# EAGLE design 8x2AND_OR_1 (EAGLE 6.5.0)

## Sheet 1 of 6
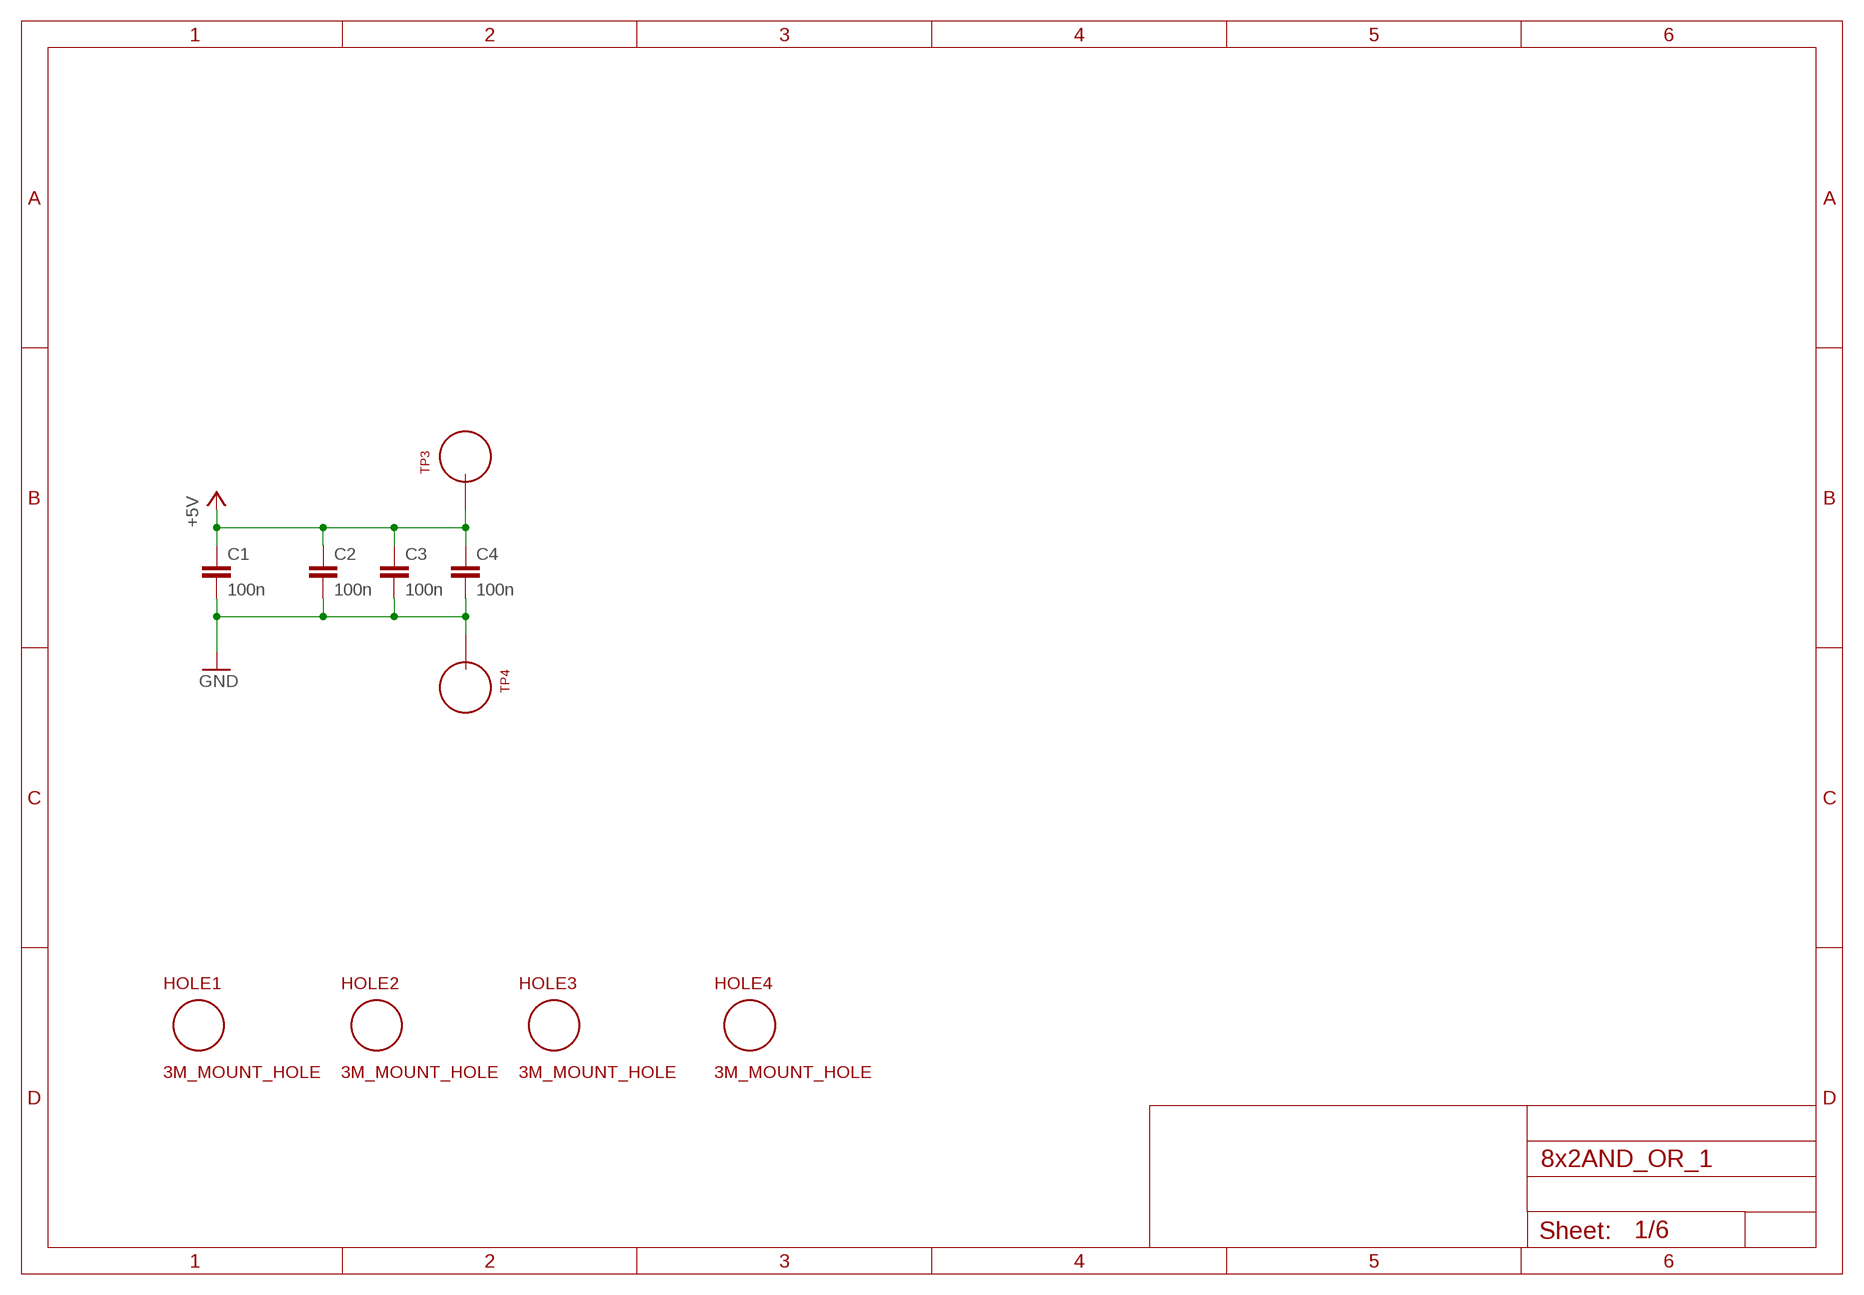
[diagram p0: schematic, sheet 1]

### Parts
C1  100n  C_P2INCH  [CAP_P2INCH]
C2  100n  C_P2INCH  [CAP_P2INCH]
C3  100n  C_P2INCH  [CAP_P2INCH]
C4  100n  C_P2INCH  [CAP_P2INCH]
HOLE1  3M_MOUNT_HOLE  [3M_HOLE]
HOLE2  3M_MOUNT_HOLE  [3M_HOLE]
HOLE3  3M_MOUNT_HOLE  [3M_HOLE]
HOLE4  3M_MOUNT_HOLE  [3M_HOLE]
TP3  TEST_LOOP  [TEST_LOOP]
TP4  TEST_LOOP  [TEST_LOOP]

### Nets
+5V: C1.1 C2.1 C3.1 C4.1 TP3.P$1 ; also sheet 2,3,4,5,6
GND: C1.2 C2.2 C3.2 C4.2 TP4.P$1 ; also sheet 2,3,4,5,6

## Sheet 2 of 6
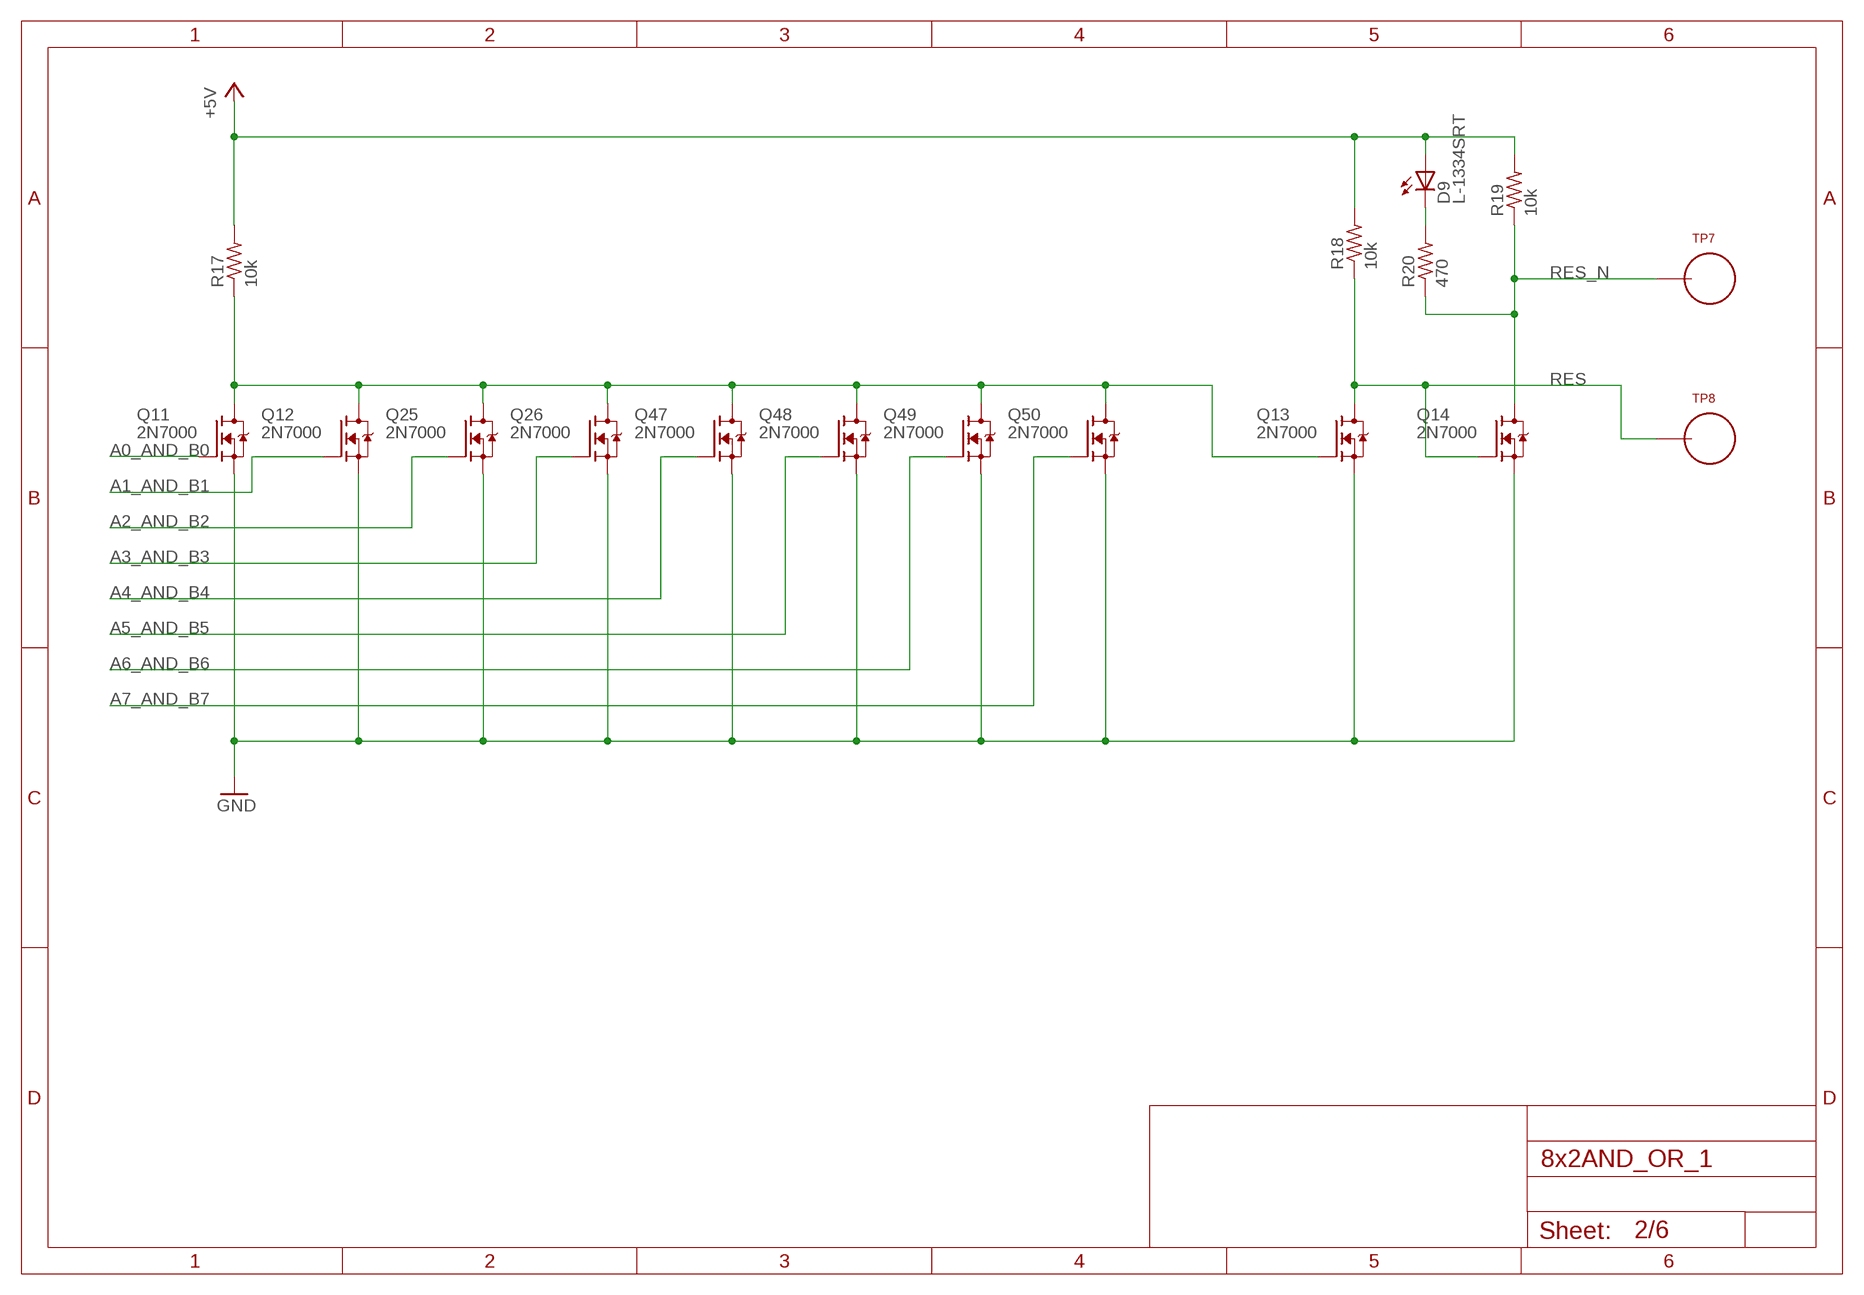
[diagram p1: schematic, sheet 2]

### Parts
D9  L-1334SRT  [LED3MM]
Q11  2N7000  [TO92-DGS]
Q12  2N7000  [TO92-DGS]
Q13  2N7000  [TO92-DGS]
Q14  2N7000  [TO92-DGS]
Q25  2N7000  [TO92-DGS]
Q26  2N7000  [TO92-DGS]
Q47  2N7000  [TO92-DGS]
Q48  2N7000  [TO92-DGS]
Q49  2N7000  [TO92-DGS]
Q50  2N7000  [TO92-DGS]
R17  10k  R_P2INCH  [R_P2INCH]
R18  10k  R_P2INCH  [R_P2INCH]
R19  10k  R_P2INCH  [R_P2INCH]
R20  470  R_P2INCH  [R_P2INCH]
TP7  TEST_LOOP  [TEST_LOOP]
TP8  TEST_LOOP  [TEST_LOOP]

### Nets
+5V: D9.A R17.2 R18.2 R19.2 ; also sheet 1,3,4,5,6
A0_AND_B0: Q11.G ; also sheet 3
A1_AND_B1: Q12.G ; also sheet 3
A2_AND_B2: Q25.G ; also sheet 4
A3_AND_B3: Q26.G ; also sheet 4
A4_AND_B4: Q47.G ; also sheet 5
A5_AND_B5: Q48.G ; also sheet 5
A6_AND_B6: Q49.G ; also sheet 6
A7_AND_B7: Q50.G ; also sheet 6
GND: Q11.S Q12.S Q13.S Q14.S Q25.S Q26.S Q47.S Q48.S Q49.S Q50.S ; also sheet 1,3,4,5,6
N$13: Q11.D Q12.D Q13.G Q25.D Q26.D Q47.D Q48.D Q49.D Q50.D R17.1
N$19: D9.K(C) R20.2
RES: Q13.D Q14.G R18.1 TP8.P$1
RES_N: Q14.D R19.1 R20.1 TP7.P$1

## Sheet 3 of 6
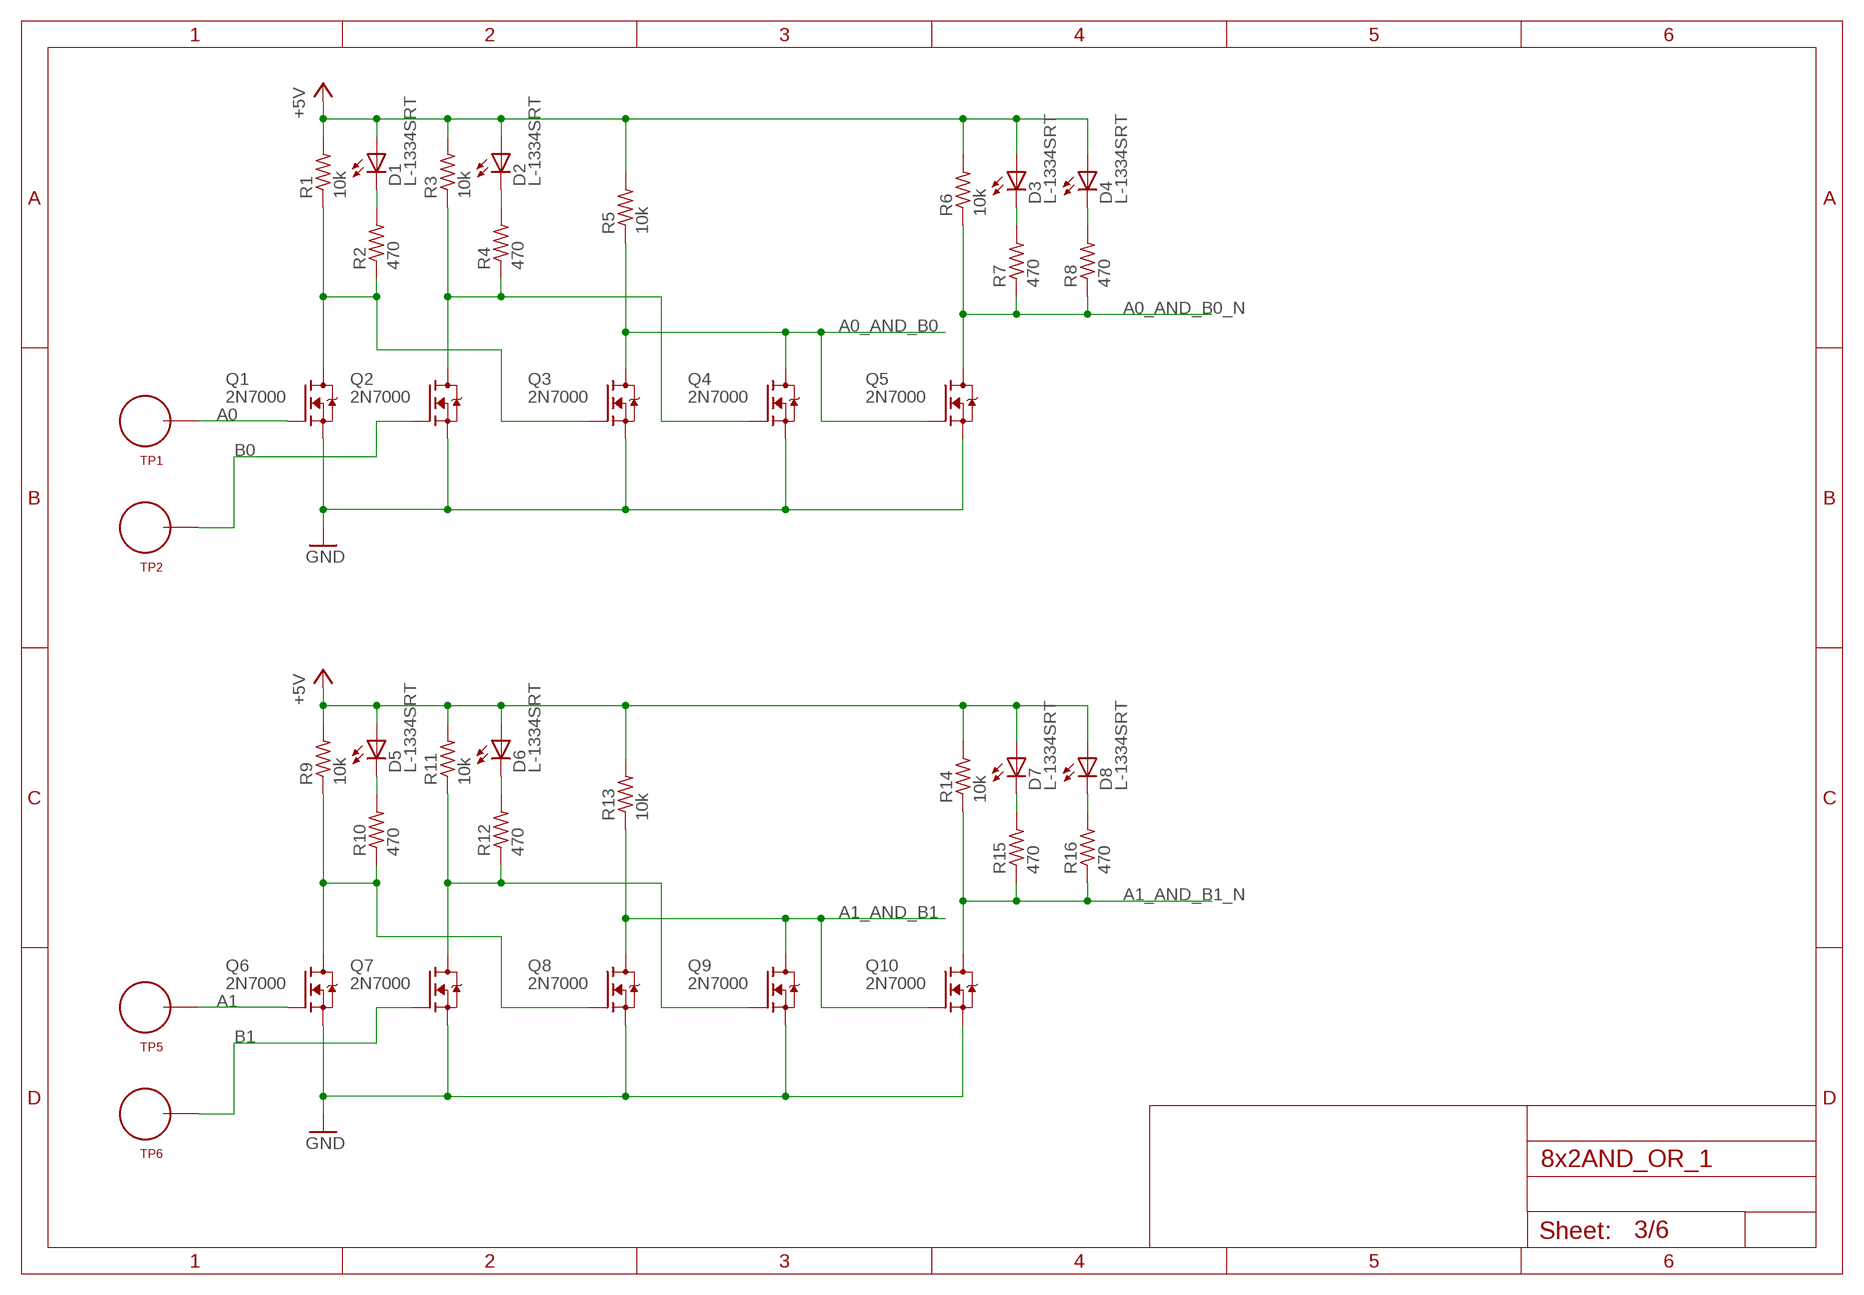
[diagram p2: schematic, sheet 3]

### Parts
D1  L-1334SRT  [LED3MM]
D2  L-1334SRT  [LED3MM]
D3  L-1334SRT  [LED3MM]
D4  L-1334SRT  [LED3MM]
D5  L-1334SRT  [LED3MM]
D6  L-1334SRT  [LED3MM]
D7  L-1334SRT  [LED3MM]
D8  L-1334SRT  [LED3MM]
Q1  2N7000  [TO92-DGS]
Q2  2N7000  [TO92-DGS]
Q3  2N7000  [TO92-DGS]
Q4  2N7000  [TO92-DGS]
Q5  2N7000  [TO92-DGS]
Q6  2N7000  [TO92-DGS]
Q7  2N7000  [TO92-DGS]
Q8  2N7000  [TO92-DGS]
Q9  2N7000  [TO92-DGS]
Q10  2N7000  [TO92-DGS]
R1  10k  R_P2INCH  [R_P2INCH]
R2  470  R_P2INCH  [R_P2INCH]
R3  10k  R_P2INCH  [R_P2INCH]
R4  470  R_P2INCH  [R_P2INCH]
R5  10k  R_P2INCH  [R_P2INCH]
R6  10k  R_P2INCH  [R_P2INCH]
R7  470  R_P2INCH  [R_P2INCH]
R8  470  R_P2INCH  [R_P2INCH]
R9  10k  R_P2INCH  [R_P2INCH]
R10  470  R_P2INCH  [R_P2INCH]
R11  10k  R_P2INCH  [R_P2INCH]
R12  470  R_P2INCH  [R_P2INCH]
R13  10k  R_P2INCH  [R_P2INCH]
R14  10k  R_P2INCH  [R_P2INCH]
R15  470  R_P2INCH  [R_P2INCH]
R16  470  R_P2INCH  [R_P2INCH]
TP1  TEST_LOOP  [TEST_LOOP]
TP2  TEST_LOOP  [TEST_LOOP]
TP5  TEST_LOOP  [TEST_LOOP]
TP6  TEST_LOOP  [TEST_LOOP]

### Nets
+5V: D1.A D2.A D3.A D4.A D5.A D6.A D7.A D8.A R1.2 R3.2 R5.2 R6.2 R9.2 R11.2 R13.2 R14.2 ; also sheet 1,2,4,5,6
A0: Q1.G TP1.P$1
A0_AND_B0: Q3.D Q4.D Q5.G R5.1 ; also sheet 2
A0_AND_B0_N: Q5.D R6.1 R7.1 R8.1
A1: Q6.G TP5.P$1
A1_AND_B1: Q8.D Q9.D Q10.G R13.1 ; also sheet 2
A1_AND_B1_N: Q10.D R14.1 R15.1 R16.1
B0: Q2.G TP2.P$1
B1: Q7.G TP6.P$1
GND: Q1.S Q2.S Q3.S Q4.S Q5.S Q6.S Q7.S Q8.S Q9.S Q10.S ; also sheet 1,2,4,5,6
N$1: D1.K(C) R2.2
N$2: Q1.D Q3.G R1.1 R2.1
N$3: D4.K(C) R8.2
N$4: D2.K(C) R4.2
N$5: Q2.D Q4.G R3.1 R4.1
N$6: D5.K(C) R10.2
N$7: Q6.D Q8.G R9.1 R10.1
N$8: D6.K(C) R12.2
N$9: D3.K(C) R7.2
N$10: Q7.D Q9.G R11.1 R12.1
N$11: D7.K(C) R15.2
N$12: D8.K(C) R16.2

## Sheet 4 of 6
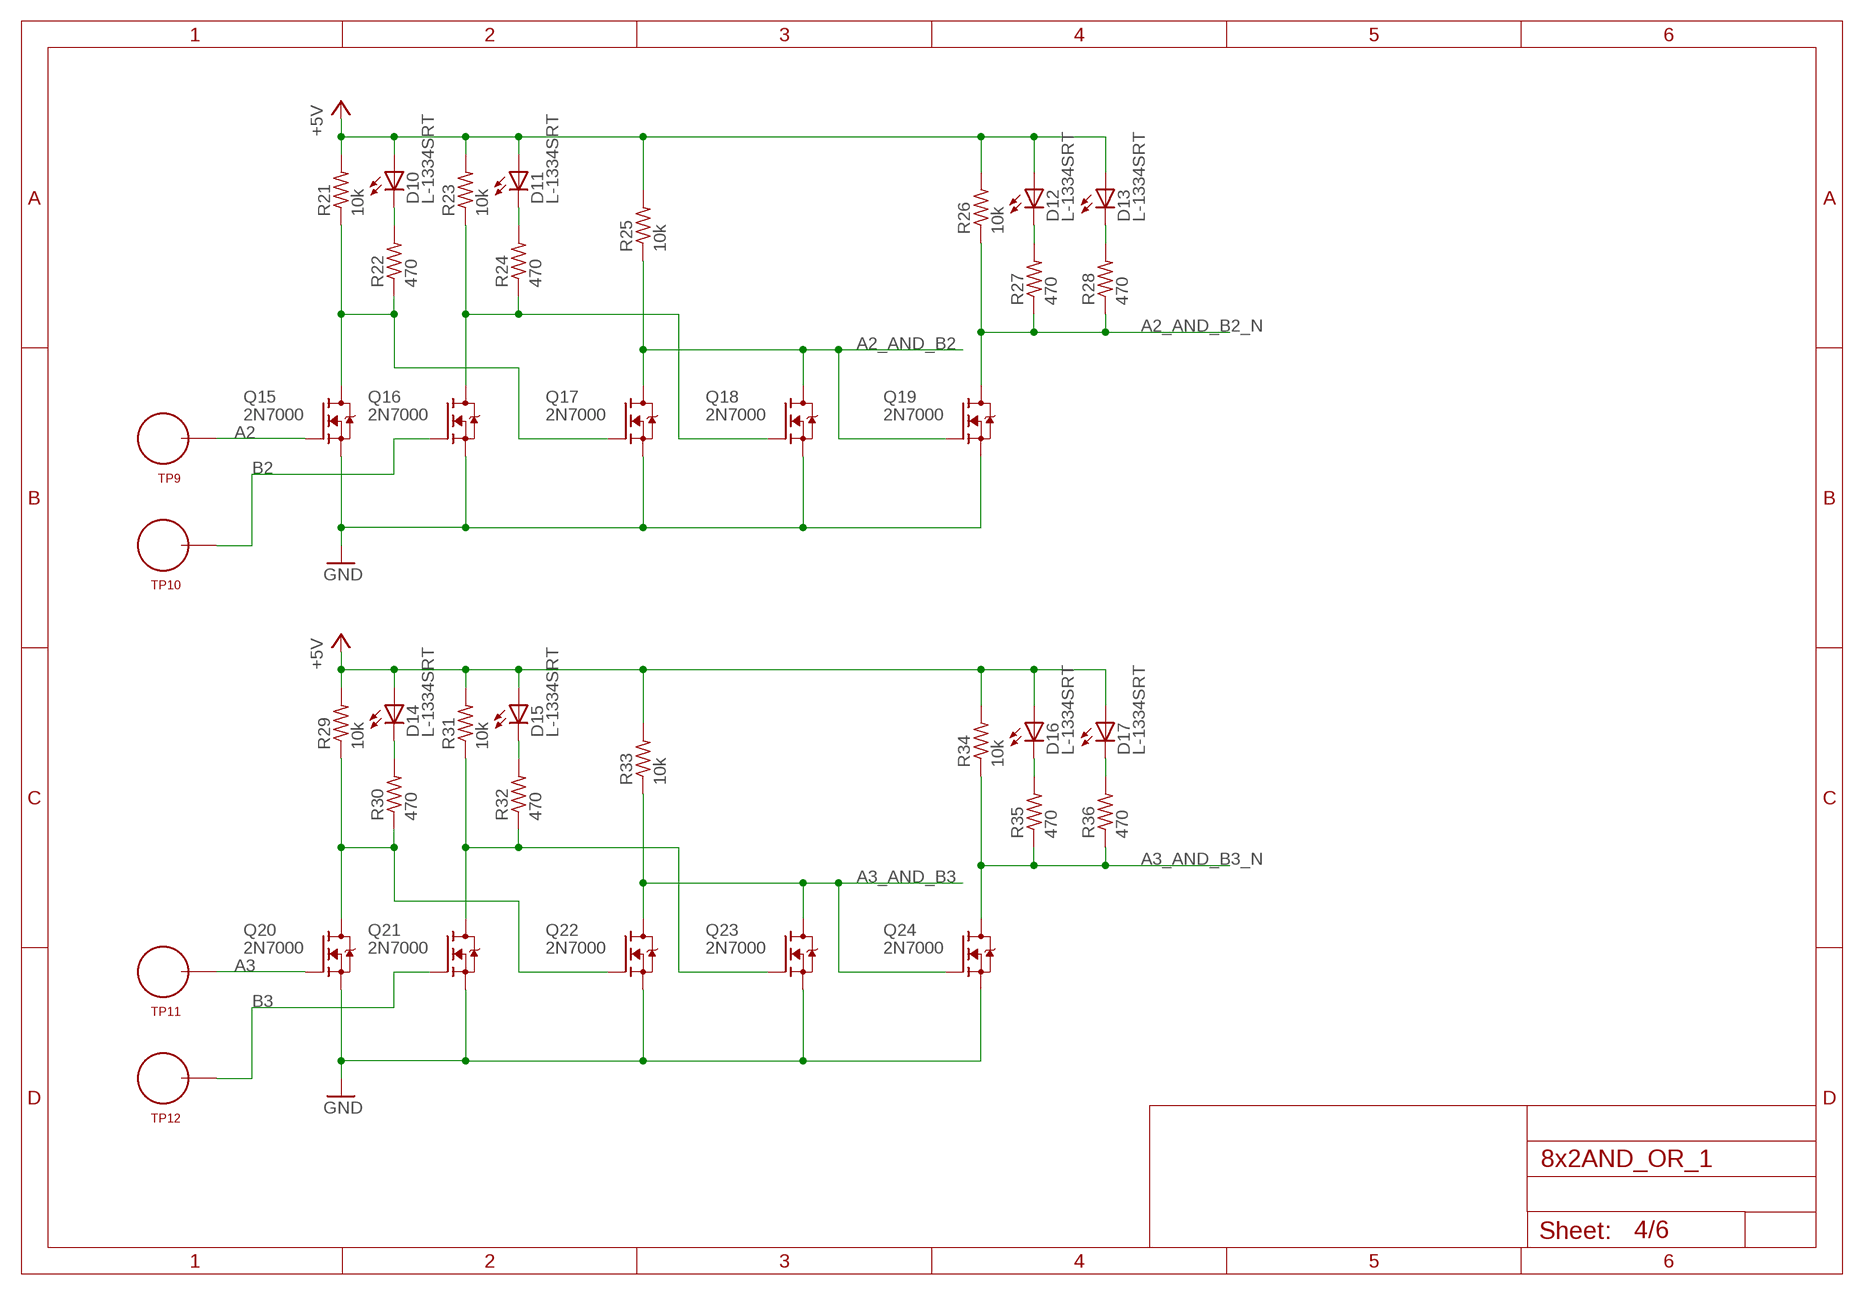
[diagram p3: schematic, sheet 4]

### Parts
D10  L-1334SRT  [LED3MM]
D11  L-1334SRT  [LED3MM]
D12  L-1334SRT  [LED3MM]
D13  L-1334SRT  [LED3MM]
D14  L-1334SRT  [LED3MM]
D15  L-1334SRT  [LED3MM]
D16  L-1334SRT  [LED3MM]
D17  L-1334SRT  [LED3MM]
Q15  2N7000  [TO92-DGS]
Q16  2N7000  [TO92-DGS]
Q17  2N7000  [TO92-DGS]
Q18  2N7000  [TO92-DGS]
Q19  2N7000  [TO92-DGS]
Q20  2N7000  [TO92-DGS]
Q21  2N7000  [TO92-DGS]
Q22  2N7000  [TO92-DGS]
Q23  2N7000  [TO92-DGS]
Q24  2N7000  [TO92-DGS]
R21  10k  R_P2INCH  [R_P2INCH]
R22  470  R_P2INCH  [R_P2INCH]
R23  10k  R_P2INCH  [R_P2INCH]
R24  470  R_P2INCH  [R_P2INCH]
R25  10k  R_P2INCH  [R_P2INCH]
R26  10k  R_P2INCH  [R_P2INCH]
R27  470  R_P2INCH  [R_P2INCH]
R28  470  R_P2INCH  [R_P2INCH]
R29  10k  R_P2INCH  [R_P2INCH]
R30  470  R_P2INCH  [R_P2INCH]
R31  10k  R_P2INCH  [R_P2INCH]
R32  470  R_P2INCH  [R_P2INCH]
R33  10k  R_P2INCH  [R_P2INCH]
R34  10k  R_P2INCH  [R_P2INCH]
R35  470  R_P2INCH  [R_P2INCH]
R36  470  R_P2INCH  [R_P2INCH]
TP9  TEST_LOOP  [TEST_LOOP]
TP10  TEST_LOOP  [TEST_LOOP]
TP11  TEST_LOOP  [TEST_LOOP]
TP12  TEST_LOOP  [TEST_LOOP]

### Nets
+5V: D10.A D11.A D12.A D13.A D14.A D15.A D16.A D17.A R21.2 R23.2 R25.2 R26.2 R29.2 R31.2 R33.2 R34.2 ; also sheet 1,2,3,5,6
A2: Q15.G TP9.P$1
A2_AND_B2: Q17.D Q18.D Q19.G R25.1 ; also sheet 2
A2_AND_B2_N: Q19.D R26.1 R27.1 R28.1
A3: Q20.G TP11.P$1
A3_AND_B3: Q22.D Q23.D Q24.G R33.1 ; also sheet 2
A3_AND_B3_N: Q24.D R34.1 R35.1 R36.1
B2: Q16.G TP10.P$1
B3: Q21.G TP12.P$1
GND: Q15.S Q16.S Q17.S Q18.S Q19.S Q20.S Q21.S Q22.S Q23.S Q24.S ; also sheet 1,2,3,5,6
N$14: D10.K(C) R22.2
N$15: Q15.D Q17.G R21.1 R22.1
N$16: D11.K(C) R24.2
N$17: Q16.D Q18.G R23.1 R24.1
N$18: D12.K(C) R27.2
N$20: D13.K(C) R28.2
N$21: D14.K(C) R30.2
N$22: Q20.D Q22.G R29.1 R30.1
N$23: D15.K(C) R32.2
N$24: Q21.D Q23.G R31.1 R32.1
N$25: D16.K(C) R35.2
N$26: D17.K(C) R36.2

## Sheet 5 of 6
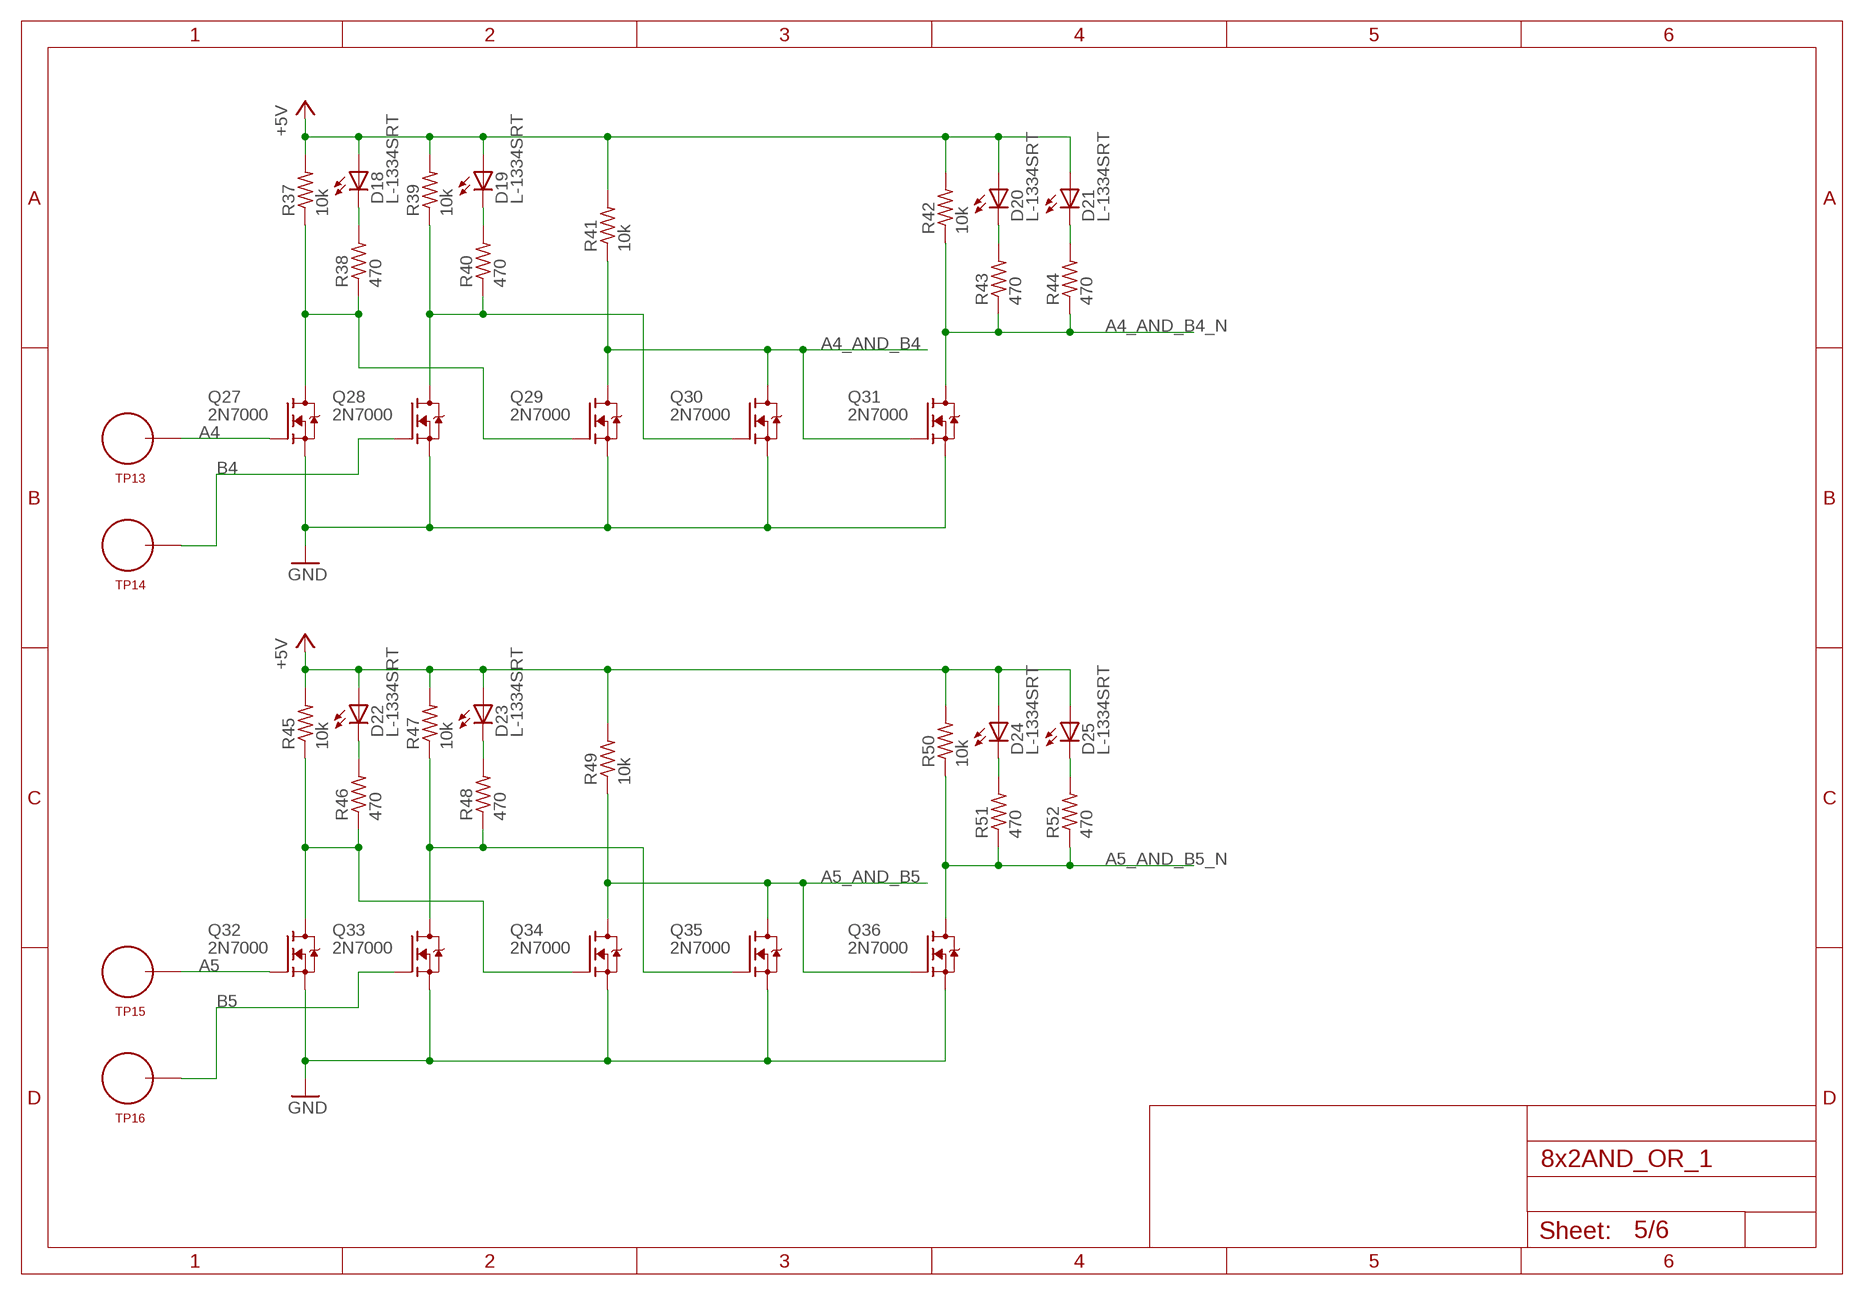
[diagram p4: schematic, sheet 5]

### Parts
D18  L-1334SRT  [LED3MM]
D19  L-1334SRT  [LED3MM]
D20  L-1334SRT  [LED3MM]
D21  L-1334SRT  [LED3MM]
D22  L-1334SRT  [LED3MM]
D23  L-1334SRT  [LED3MM]
D24  L-1334SRT  [LED3MM]
D25  L-1334SRT  [LED3MM]
Q27  2N7000  [TO92-DGS]
Q28  2N7000  [TO92-DGS]
Q29  2N7000  [TO92-DGS]
Q30  2N7000  [TO92-DGS]
Q31  2N7000  [TO92-DGS]
Q32  2N7000  [TO92-DGS]
Q33  2N7000  [TO92-DGS]
Q34  2N7000  [TO92-DGS]
Q35  2N7000  [TO92-DGS]
Q36  2N7000  [TO92-DGS]
R37  10k  R_P2INCH  [R_P2INCH]
R38  470  R_P2INCH  [R_P2INCH]
R39  10k  R_P2INCH  [R_P2INCH]
R40  470  R_P2INCH  [R_P2INCH]
R41  10k  R_P2INCH  [R_P2INCH]
R42  10k  R_P2INCH  [R_P2INCH]
R43  470  R_P2INCH  [R_P2INCH]
R44  470  R_P2INCH  [R_P2INCH]
R45  10k  R_P2INCH  [R_P2INCH]
R46  470  R_P2INCH  [R_P2INCH]
R47  10k  R_P2INCH  [R_P2INCH]
R48  470  R_P2INCH  [R_P2INCH]
R49  10k  R_P2INCH  [R_P2INCH]
R50  10k  R_P2INCH  [R_P2INCH]
R51  470  R_P2INCH  [R_P2INCH]
R52  470  R_P2INCH  [R_P2INCH]
TP13  TEST_LOOP  [TEST_LOOP]
TP14  TEST_LOOP  [TEST_LOOP]
TP15  TEST_LOOP  [TEST_LOOP]
TP16  TEST_LOOP  [TEST_LOOP]

### Nets
+5V: D18.A D19.A D20.A D21.A D22.A D23.A D24.A D25.A R37.2 R39.2 R41.2 R42.2 R45.2 R47.2 R49.2 R50.2 ; also sheet 1,2,3,4,6
A4: Q27.G TP13.P$1
A4_AND_B4: Q29.D Q30.D Q31.G R41.1 ; also sheet 2
A4_AND_B4_N: Q31.D R42.1 R43.1 R44.1
A5: Q32.G TP15.P$1
A5_AND_B5: Q34.D Q35.D Q36.G R49.1 ; also sheet 2
A5_AND_B5_N: Q36.D R50.1 R51.1 R52.1
B4: Q28.G TP14.P$1
B5: Q33.G TP16.P$1
GND: Q27.S Q28.S Q29.S Q30.S Q31.S Q32.S Q33.S Q34.S Q35.S Q36.S ; also sheet 1,2,3,4,6
N$27: D18.K(C) R38.2
N$28: Q27.D Q29.G R37.1 R38.1
N$29: D19.K(C) R40.2
N$30: Q28.D Q30.G R39.1 R40.1
N$31: D20.K(C) R43.2
N$32: D21.K(C) R44.2
N$33: D22.K(C) R46.2
N$34: Q32.D Q34.G R45.1 R46.1
N$35: D23.K(C) R48.2
N$36: Q33.D Q35.G R47.1 R48.1
N$37: D24.K(C) R51.2
N$38: D25.K(C) R52.2

## Sheet 6 of 6
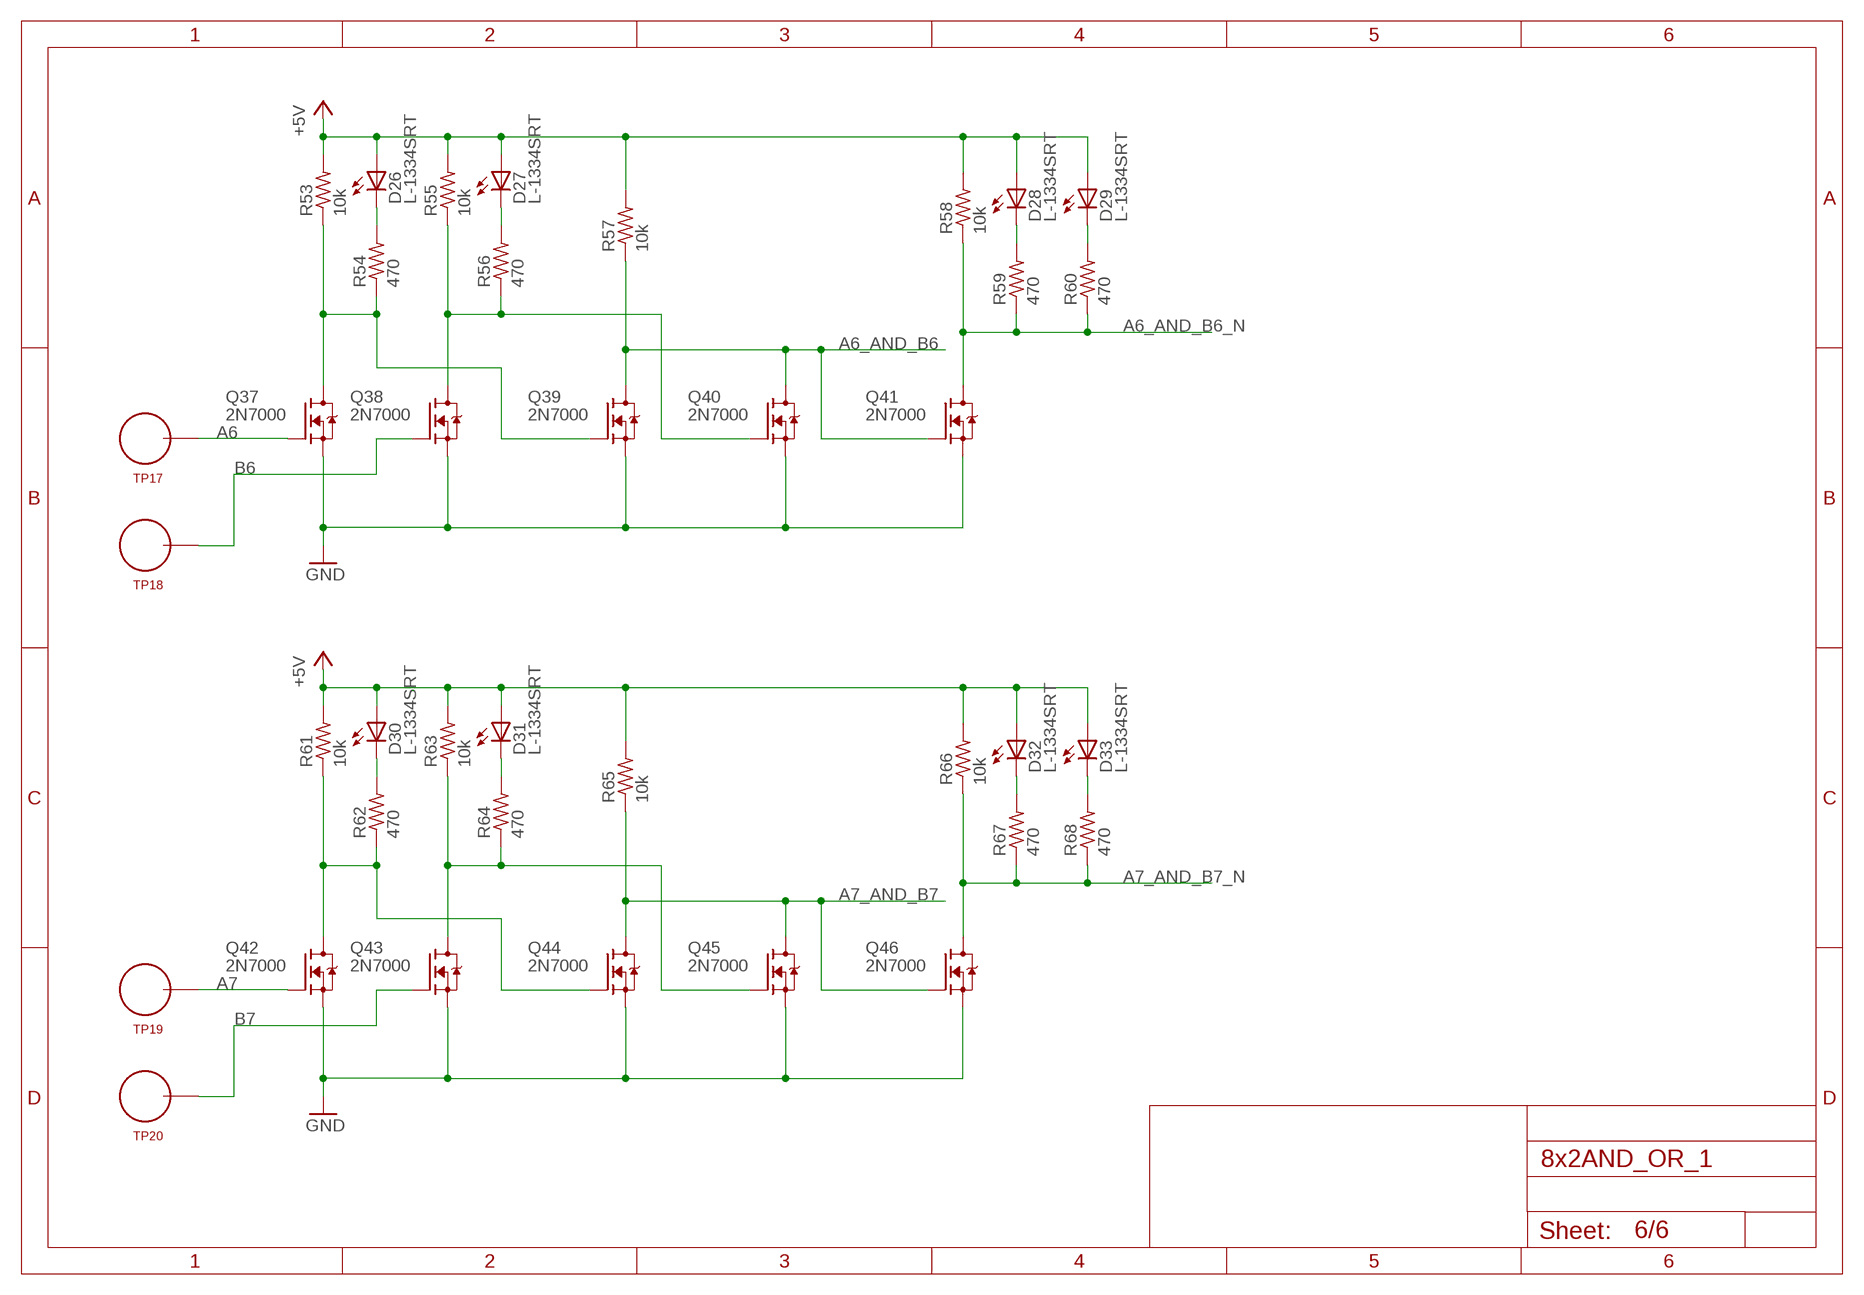
[diagram p5: schematic, sheet 6]

### Parts
D26  L-1334SRT  [LED3MM]
D27  L-1334SRT  [LED3MM]
D28  L-1334SRT  [LED3MM]
D29  L-1334SRT  [LED3MM]
D30  L-1334SRT  [LED3MM]
D31  L-1334SRT  [LED3MM]
D32  L-1334SRT  [LED3MM]
D33  L-1334SRT  [LED3MM]
Q37  2N7000  [TO92-DGS]
Q38  2N7000  [TO92-DGS]
Q39  2N7000  [TO92-DGS]
Q40  2N7000  [TO92-DGS]
Q41  2N7000  [TO92-DGS]
Q42  2N7000  [TO92-DGS]
Q43  2N7000  [TO92-DGS]
Q44  2N7000  [TO92-DGS]
Q45  2N7000  [TO92-DGS]
Q46  2N7000  [TO92-DGS]
R53  10k  R_P2INCH  [R_P2INCH]
R54  470  R_P2INCH  [R_P2INCH]
R55  10k  R_P2INCH  [R_P2INCH]
R56  470  R_P2INCH  [R_P2INCH]
R57  10k  R_P2INCH  [R_P2INCH]
R58  10k  R_P2INCH  [R_P2INCH]
R59  470  R_P2INCH  [R_P2INCH]
R60  470  R_P2INCH  [R_P2INCH]
R61  10k  R_P2INCH  [R_P2INCH]
R62  470  R_P2INCH  [R_P2INCH]
R63  10k  R_P2INCH  [R_P2INCH]
R64  470  R_P2INCH  [R_P2INCH]
R65  10k  R_P2INCH  [R_P2INCH]
R66  10k  R_P2INCH  [R_P2INCH]
R67  470  R_P2INCH  [R_P2INCH]
R68  470  R_P2INCH  [R_P2INCH]
TP17  TEST_LOOP  [TEST_LOOP]
TP18  TEST_LOOP  [TEST_LOOP]
TP19  TEST_LOOP  [TEST_LOOP]
TP20  TEST_LOOP  [TEST_LOOP]

### Nets
+5V: D26.A D27.A D28.A D29.A D30.A D31.A D32.A D33.A R53.2 R55.2 R57.2 R58.2 R61.2 R63.2 R65.2 R66.2 ; also sheet 1,2,3,4,5
A6: Q37.G TP17.P$1
A6_AND_B6: Q39.D Q40.D Q41.G R57.1 ; also sheet 2
A6_AND_B6_N: Q41.D R58.1 R59.1 R60.1
A7: Q42.G TP19.P$1
A7_AND_B7: Q44.D Q45.D Q46.G R65.1 ; also sheet 2
A7_AND_B7_N: Q46.D R66.1 R67.1 R68.1
B6: Q38.G TP18.P$1
B7: Q43.G TP20.P$1
GND: Q37.S Q38.S Q39.S Q40.S Q41.S Q42.S Q43.S Q44.S Q45.S Q46.S ; also sheet 1,2,3,4,5
N$39: D26.K(C) R54.2
N$40: Q37.D Q39.G R53.1 R54.1
N$41: D27.K(C) R56.2
N$42: Q38.D Q40.G R55.1 R56.1
N$43: D28.K(C) R59.2
N$44: D29.K(C) R60.2
N$45: D30.K(C) R62.2
N$46: Q42.D Q44.G R61.1 R62.1
N$47: D31.K(C) R64.2
N$48: Q43.D Q45.G R63.1 R64.1
N$49: D32.K(C) R67.2
N$50: D33.K(C) R68.2

## Library data of the parts
C1-C4 = MyLib:C_P2INCH
D1-D33 = MyLib:L-1334SRT
HOLE1-HOLE4 = MyLib:3M_MOUNT_HOLE
Q1-Q50 = MyLib:2N7000
R1-R68 = MyLib:R_P2INCH
TP1-TP20 = MyLib:TEST_LOOP

## Board
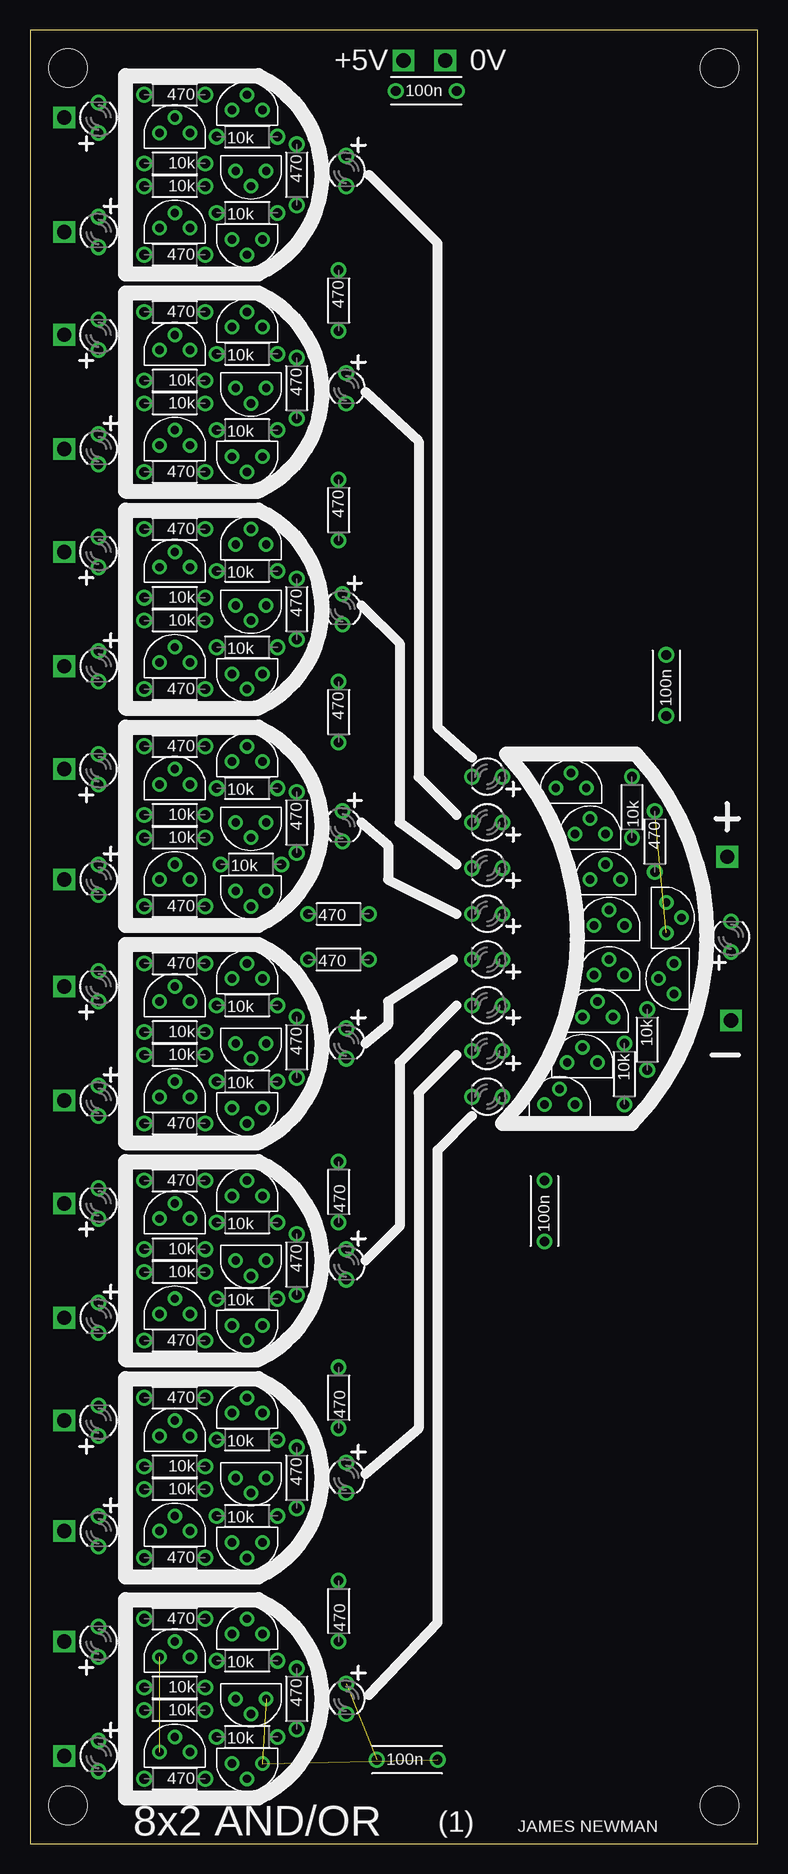
[diagram p6: board, top side]
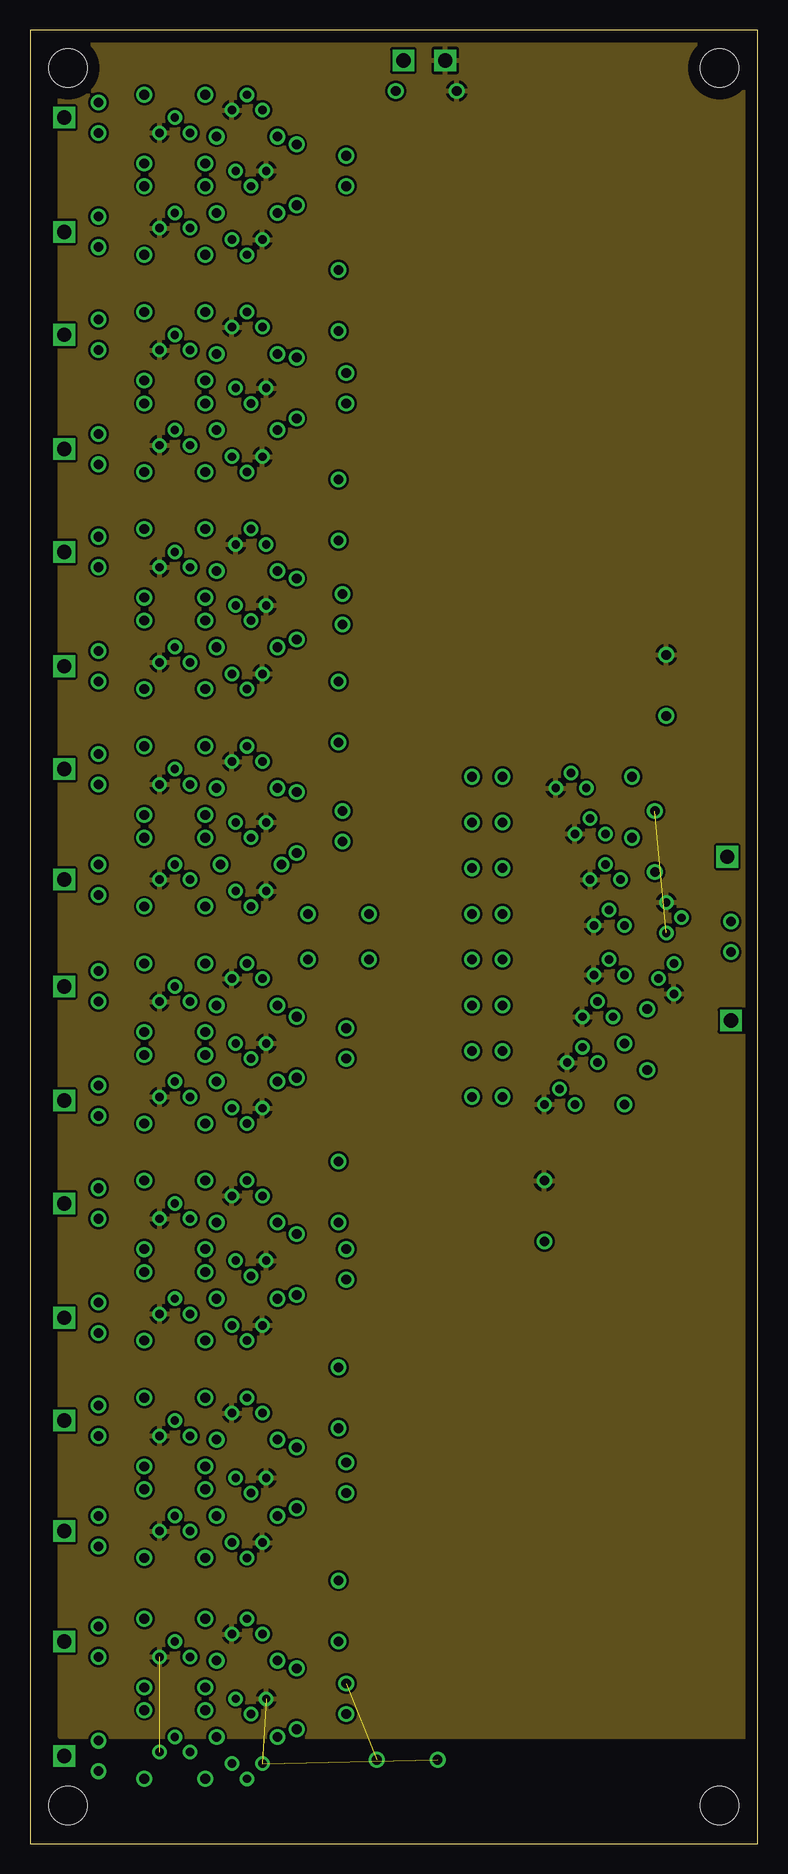
[diagram p7: board, inner layer Route2]
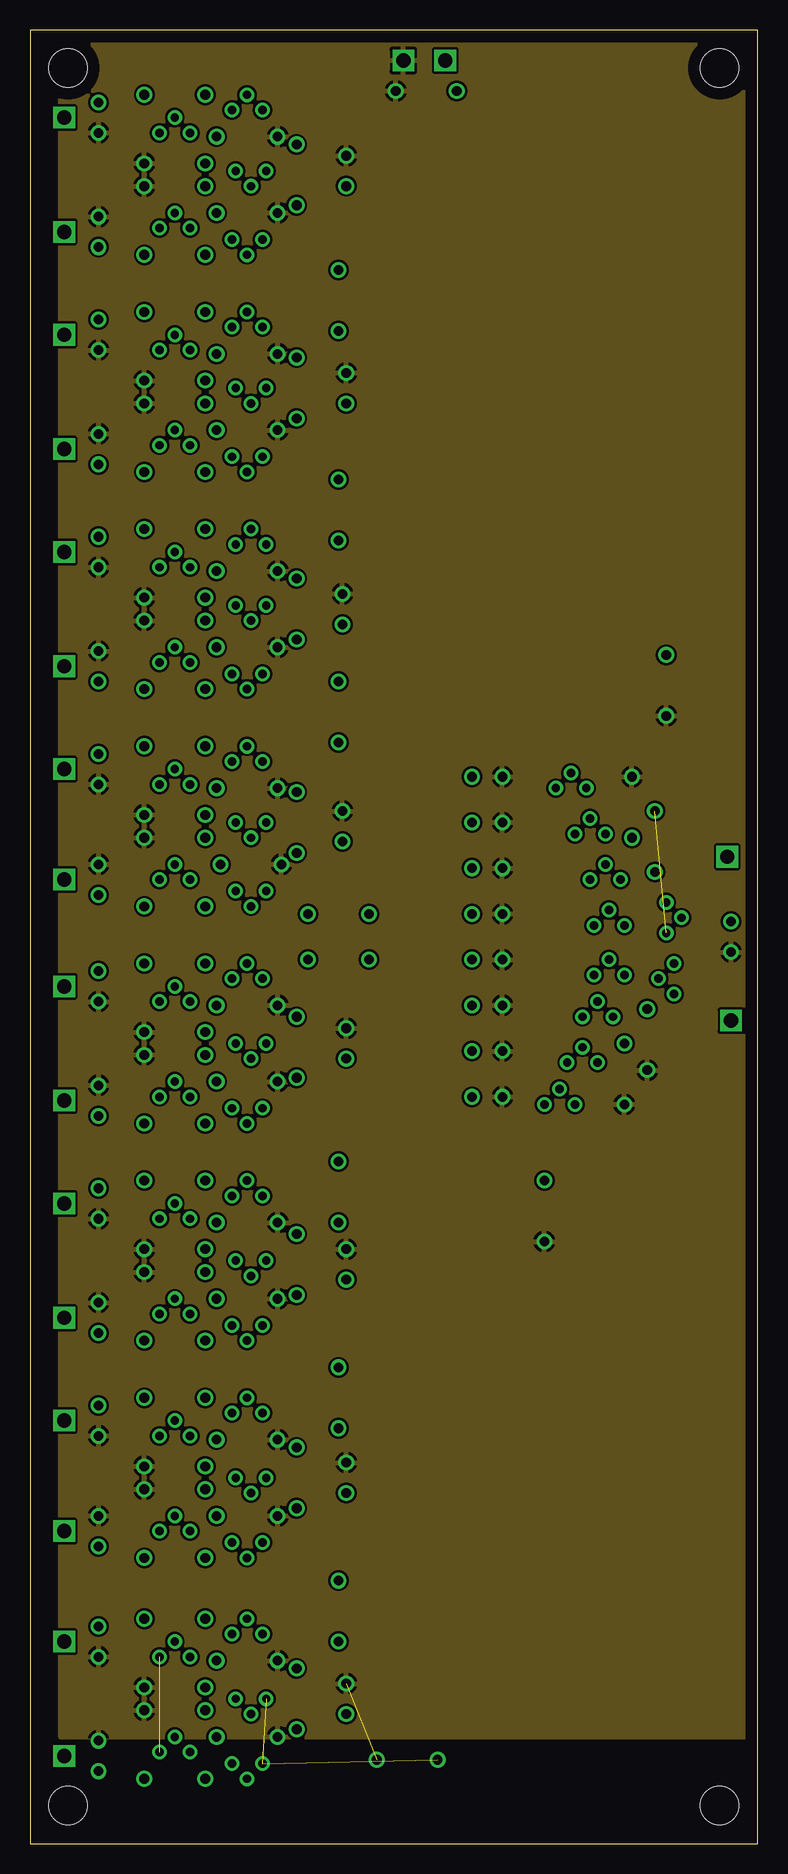
[diagram p8: board, inner layer Route3]
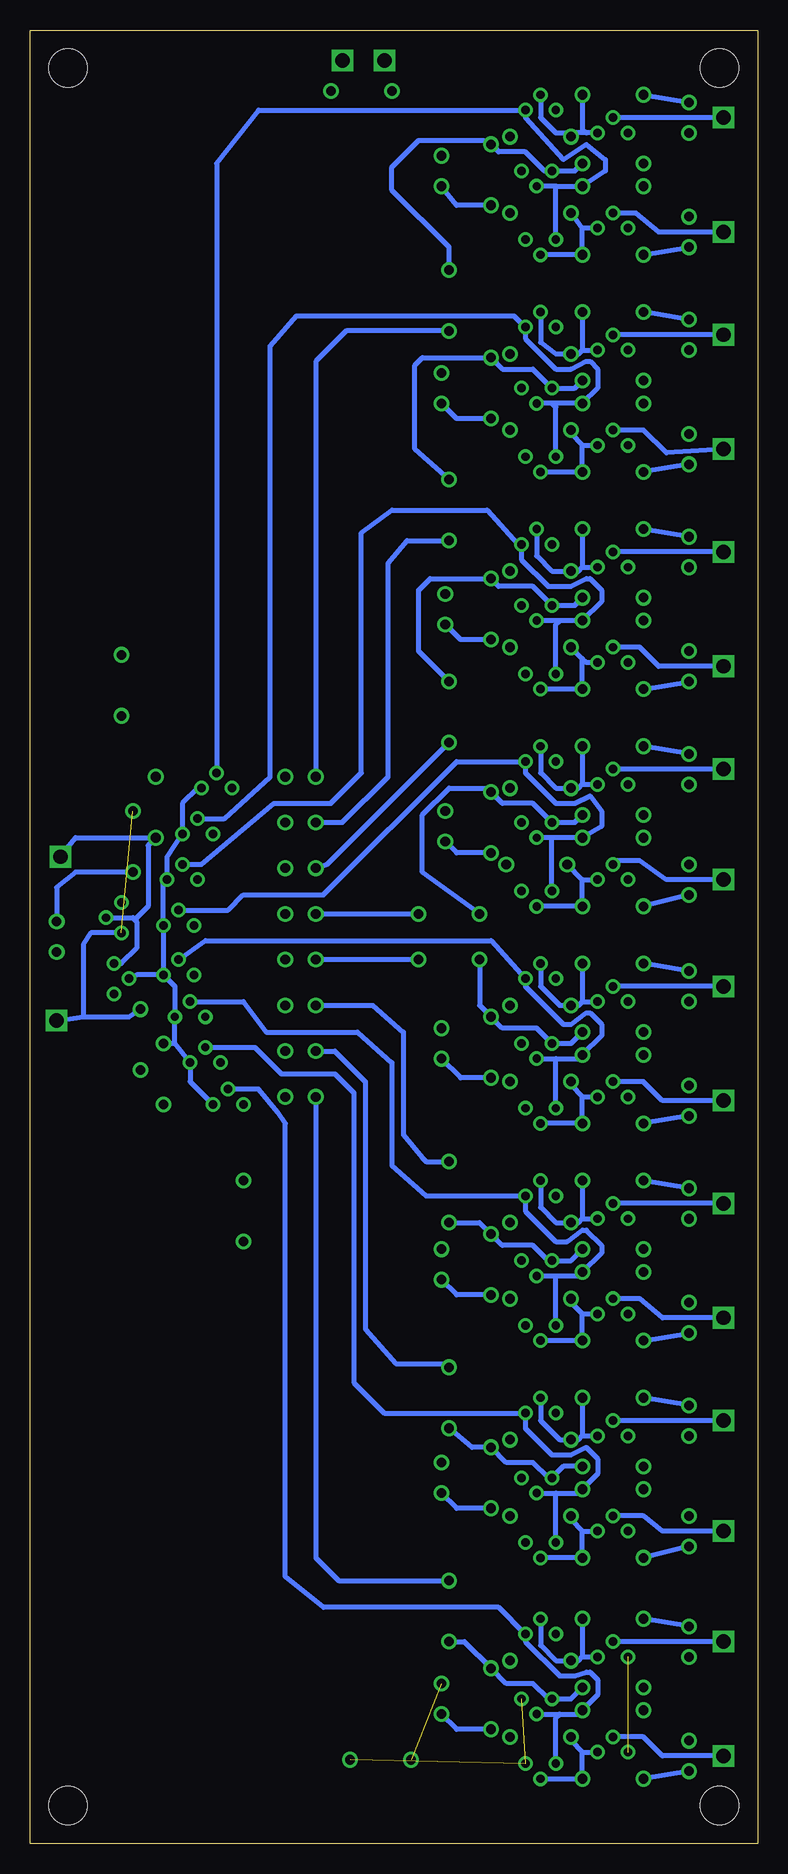
[diagram p9: board, bottom side, seen from below]

Size 60.64 x 151.13 mm. Coordinates in mm from the lower left corner, seen from the top.
Outline: 0,0 60.64,0 60.64,151.13 0,151.13 0,0
Copper layers (1*2+3*16): Top 0.035mm / dielectric 0.2mm / Route2 0.035mm / dielectric 1mm / Route3 0.035mm / dielectric 0.2mm / Bottom 0.035mm
Design rules "processor_rules_4layer": minimum track width 10mil, minimum drill 0.0236mm, track to track 8mil, track to pad 8mil, pad to pad 8mil, via to via 8mil, smd to smd 8mil, copper to edge 40mil, drill to drill 8mil, minimum pad ring 10mil, minimum via ring 8mil, stop-mask expansion 4mil, vias tented up to drill 0.7mm, thermal gap 10mil

### Footprints (pad centres in the part's own frame; a part is rotated, then mirrored left to right if it is on the bottom)
CAP_P2INCH = drill 0.8: 1 -2.54,0; 2 2.54,0
LED3MM = drill 0.8: A -1.27,0; K 1.27,0
3M_HOLE = hole 3.2: 0,0
TO92-DGS = drill 0.7: D 0,1.27; G -1.27,0; S 0,-1.27
R_P2INCH = drill 0.8: 1 -2.54,0; 2 2.54,0
TEST_LOOP = drill 1.2 square: P$1 0,0

### Placement (x,y rotation side)
C1  33.02,146.05 0 top
C2  42.86,52.7 90 top
C3  53.02,96.52 90 top
C4  31.43,6.99 0 top
D1  5.71,143.83 90 top
D2  5.71,134.3 270 top
D3  26.35,139.38 270 top
D4  38.1,88.9 180 top
D5  5.71,125.73 90 top
D6  5.71,116.2 270 top
D7  26.35,121.28 270 top
D8  38.1,85.09 180 top
D9  58.42,75.56 90 top
D10  5.71,107.63 90 top
D11  5.71,98.11 270 top
D12  26.04,102.87 270 top
D13  38.1,81.28 180 top
D14  5.71,89.53 90 top
D15  5.71,80.33 270 top
D16  26.04,84.77 270 top
D17  38.1,77.47 180 top
D18  5.71,71.44 90 top
D19  5.71,61.91 270 top
D20  26.35,66.67 270 top
D21  38.1,73.66 180 top
D22  5.71,53.34 90 top
D23  5.71,43.81 270 top
D24  26.35,48.26 270 top
D25  38.1,69.85 180 top
D26  5.71,35.24 90 top
D27  5.71,26.04 270 top
D28  26.35,30.48 270 top
D29  38.1,66.04 180 top
D30  5.71,16.83 90 top
D31  5.71,7.3 270 top
D32  26.35,12.06 270 top
D33  38.1,62.23 180 top
HOLE1  3.17,3.17 0 top
HOLE2  57.47,3.17 0 top
HOLE3  3.17,147.96 0 top
HOLE4  57.47,147.96 0 top
Q1  12.06,142.56 270 top
Q2  12.06,134.62 270 top
Q3  18.1,144.46 270 top
Q4  18.1,133.67 90 top
Q5  18.41,139.38 90 top
Q6  12.06,124.46 270 top
Q7  12.06,116.52 270 top
Q8  18.1,126.36 270 top
Q9  18.1,115.57 90 top
Q10  18.41,121.28 90 top
Q11  45.09,87.95 270 top
Q12  46.67,84.14 270 top
Q13  53.66,72.07 0 top
Q14  53.02,77.15 180 top
Q15  12.06,106.36 270 top
Q16  12.06,98.42 270 top
Q17  18.41,108.27 270 top
Q18  18.1,97.47 90 top
Q19  18.41,103.19 90 top
Q20  12.06,88.27 270 top
Q21  12.06,80.33 270 top
Q22  18.1,90.17 270 top
Q23  18.41,79.38 90 top
Q24  18.41,85.09 90 top
Q25  47.94,80.33 270 top
Q26  48.26,76.52 270 top
Q27  12.06,70.17 270 top
Q28  12.06,62.23 270 top
Q29  18.1,72.07 270 top
Q30  18.1,61.28 90 top
Q31  18.41,66.67 90 top
Q32  12.06,52.07 270 top
Q33  12.06,44.13 270 top
Q34  18.1,53.98 270 top
Q35  18.1,43.18 90 top
Q36  18.41,48.58 90 top
Q37  12.06,33.97 270 top
Q38  12.06,26.04 270 top
Q39  18.1,35.88 270 top
Q40  18.1,25.08 90 top
Q41  18.41,30.48 90 top
Q42  12.06,15.56 270 top
Q43  12.06,7.62 270 top
Q44  18.1,17.46 270 top
Q45  18.1,6.67 90 top
Q46  18.41,12.06 90 top
Q47  48.26,72.39 270 top
Q48  47.31,68.9 270 top
Q49  46.04,65.09 270 top
Q50  44.13,61.59 270 top
R1  18.1,142.24 0 top
R2  12.06,145.73 180 top
R3  18.1,135.89 0 top
R4  12.06,132.4 180 top
R5  12.06,138.11 180 top
R6  12.06,140.02 180 top
R7  22.23,139.06 270 top
R8  25.72,128.59 270 top
R9  18.1,124.14 0 top
R10  12.06,127.64 180 top
R11  18.1,117.79 0 top
R12  12.06,114.3 180 top
R13  12.06,120.02 180 top
R14  12.06,121.92 180 top
R15  22.23,121.28 270 top
R16  25.72,111.12 270 top
R17  49.53,64.14 270 top
R18  50.16,86.36 90 top
R19  51.44,66.99 270 top
R20  52.07,83.5 270 top
R21  18.1,106.05 0 top
R22  12.06,109.54 180 top
R23  18.1,99.69 0 top
R24  12.06,96.2 180 top
R25  12.06,101.92 180 top
R26  12.06,103.82 180 top
R27  22.23,102.87 270 top
R28  25.72,94.3 270 top
R29  18.1,87.95 0 top
R30  12.06,91.44 180 top
R31  18.41,81.6 0 top
R32  12.06,78.11 180 top
R33  12.06,83.82 180 top
R34  12.06,85.72 180 top
R35  22.23,85.09 270 top
R36  25.72,77.47 0 top
R37  18.1,69.85 0 top
R38  12.06,73.34 180 top
R39  18.1,63.5 0 top
R40  12.06,60.01 180 top
R41  12.06,65.72 180 top
R42  12.06,67.63 180 top
R43  22.23,66.36 270 top
R44  25.72,73.66 0 top
R45  18.1,51.75 0 top
R46  12.06,55.24 180 top
R47  18.1,45.4 0 top
R48  12.06,41.91 180 top
R49  12.06,47.62 180 top
R50  12.06,49.53 180 top
R51  22.23,48.26 270 top
R52  25.72,54.29 90 top
R53  18.1,33.66 0 top
R54  12.06,37.15 180 top
R55  18.1,27.3 0 top
R56  12.06,23.81 180 top
R57  12.06,29.53 180 top
R58  12.06,31.43 180 top
R59  22.23,30.48 270 top
R60  25.72,37.15 90 top
R61  18.1,15.24 0 top
R62  12.06,18.73 180 top
R63  18.1,8.89 0 top
R64  12.06,5.4 180 top
R65  12.06,11.11 180 top
R66  12.06,13.02 180 top
R67  22.23,12.06 270 top
R68  25.72,19.37 90 top
TP1  2.86,143.83 0 top
TP2  2.86,134.3 0 top
TP3  31.11,148.59 0 top
TP4  34.61,148.59 0 top
TP5  2.86,125.73 0 top
TP6  2.86,116.2 0 top
TP7  58.42,68.58 0 top
TP8  58.1,82.23 0 top
TP9  2.86,107.63 0 top
TP10  2.86,98.11 0 top
TP11  2.86,89.53 0 top
TP12  2.86,80.33 0 top
TP13  2.86,71.44 0 top
TP14  2.86,61.91 0 top
TP15  2.86,53.34 0 top
TP16  2.86,43.81 0 top
TP17  2.86,35.24 0 top
TP18  2.86,26.04 0 top
TP19  2.86,16.83 0 top
TP20  2.86,7.3 0 top

### Tracks (layer width: path | path; a pad name or v marks a point on that pad's centre or on a via)
+5V  (1 unrouted)
  pour Route3: 2.54,154.62 2.54,8.89 59.69,8.89 59.69,154.62
A0
  Bottom 0.406: TP1.P$1 Q1.G
A0_AND_B0
  Bottom 0.406: Q4.D 16.83,138.11 | 16.83,138.11 Q5.G | 16.83,138.11 R5.1 12.7,139.38 12.7,140.34 14.29,141.6 16.19,140.34 19.37,143.83 Q3.D 41.59,144.46 45.09,140.02 Q11.G
A0_AND_B0_N
  Bottom 0.406: R6.1 15.24,139.38 Q5.D 17.78,139.38 19.37,140.97 21.59,140.97 R7.1 22.86,141.92 28.26,141.92 30.48,139.7 30.48,137.79 25.72,133.03 R8.1
A1
  Bottom 0.406: TP5.P$1 Q6.G
A1_AND_B1
  Bottom 0.406: 17.14,120.02 R13.1 13.34,121.28 13.34,122.87 13.97,123.51 14.29,123.51 15.56,122.87 16.83,122.87 19.37,125.41 Q8.D 20.32,127.32 38.42,127.32 40.64,124.78 40.64,88.9 44.45,85.41 Q12.G | 17.14,120.02 Q10.G | Q9.D 16.83,119.7 17.14,120.02
A1_AND_B1_N
  Bottom 0.406: R14.1 15.24,121.28 Q10.D 18.73,122.87 21.27,122.87 R15.1 27.94,123.83 28.57,123.19 28.57,116.2 R16.1
A2
  Bottom 0.406: TP9.P$1 Q15.G
A2_AND_B2
  Bottom 0.406: 16.51,101.92 R25.1 13.02,103.5 13.02,104.46 13.97,105.41 14.29,105.41 15.56,104.78 17.46,104.78 19.68,107 Q17.D 20,108.27 22.54,111.12 30.48,111.12 33.02,109.22 33.02,89.22 35.56,86.68 40.32,86.68 46.35,81.6 Q25.G | 16.51,101.92 Q19.G | Q18.D 16.83,101.6 16.51,101.92
A2_AND_B2_N
  Bottom 0.406: R26.1 15.24,103.19 Q19.D 18.73,104.78 21.59,104.78 R27.1 27.3,105.41 28.26,104.46 28.26,99.38 R28.1
A3
  Bottom 0.406: TP11.P$1 Q20.G
A3_AND_B3
  Bottom 0.406: 17.14,83.82 R33.1 13.02,84.77 13.02,86.04 13.97,87.31 15.24,86.68 16.83,86.68 19.37,89.22 Q22.D 25.08,90.17 36.2,79.06 42.86,79.06 44.13,77.79 Q26.G | 17.14,83.82 Q24.G | Q23.D 17.14,83.82
A3_AND_B3_N
  Bottom 0.406: R34.1 15.24,85.09 Q24.D 18.73,86.68 21.27,86.68 R35.1 22.54,87.95 25.72,87.95 27.94,85.72 27.94,80.96 R36.1
A4
  Bottom 0.406: TP13.P$1 Q27.G
A4_AND_B4
  Bottom 0.406: Q31.G 16.83,65.41 | 16.83,65.41 14.92,65.41 R41.1 13.02,67.31 13.02,68.26 13.97,69.22 14.29,69.22 15.56,68.26 16.19,68.26 19.37,71.44 Q29.D 22.23,75.25 46.04,75.25 Q47.G | Q30.D 16.83,65.41
A4_AND_B4_N
  Bottom 0.406: R42.1 15.56,66.67 Q31.D 18.41,67.94 21.27,67.94 R43.1 23.18,69.85 R44.1
A5
  Bottom 0.406: TP15.P$1 Q32.G
A5_AND_B5
  Bottom 0.406: Q36.G 16.83,47.31 | 16.83,47.31 14.92,47.31 R49.1 13.02,49.21 13.02,49.85 14.29,51.12 14.61,51.12 15.88,50.16 16.83,50.16 19.37,52.7 Q34.D 27.62,53.98 30.48,56.52 30.48,65.09 33.34,67.63 40.96,67.63 42.86,70.17 Q48.G | Q35.D 16.83,47.31
A5_AND_B5_N
  Bottom 0.406: R50.1 15.56,48.58 Q36.D 17.46,48.58 18.73,49.85 21.27,49.85 R51.1 23.18,51.75 R52.1
A6
  Bottom 0.406: TP17.P$1 Q37.G
A6_AND_B6
  Bottom 0.406: Q41.G 16.83,29.21 | 16.83,29.21 14.92,29.21 R57.1 13.34,30.8 13.34,32.07 14.29,33.02 15.56,32.38 17.14,32.38 19.37,34.61 Q39.D 31.11,35.88 33.66,38.42 33.66,62.55 35.24,64.14 39.69,64.14 41.91,66.36 Q49.G | Q40.D 16.83,29.21
A6_AND_B6_N
  Bottom 0.406: R58.1 16.19,31.43 Q41.D 17.46,30.48 18.73,31.75 20.95,31.75 R59.1 23.81,33.02 R60.1
A7
  Bottom 0.406: TP19.P$1 Q42.G
A7_AND_B7
  Bottom 0.406: Q46.G 16.51,10.79 | 16.51,10.79 14.92,10.79 R65.1 13.34,12.38 13.34,13.65 13.97,14.29 14.29,14.29 15.24,13.97 16.51,13.97 19.37,16.83 Q44.D 21.59,19.68 36.2,19.68 39.37,22.23 39.37,60.01 40.01,60.96 41.59,62.87 Q50.G | Q45.D 16.83,10.48 16.51,10.79
A7_AND_B7_N
  Bottom 0.406: R66.1 15.56,12.06 Q46.D 17.46,12.06 18.73,13.34 20.95,13.34 R67.1 24.45,16.83 R68.1
B0
  Bottom 0.406: Q2.G 10.16,135.89 8.26,134.3 TP2.P$1
B1
  Bottom 0.406: TP6.P$1 7.62,115.89 9.53,117.79 Q7.G
B2
  Bottom 0.406: TP10.P$1 8.26,98.11 9.84,99.69 Q16.G
B3
  Bottom 0.406: TP12.P$1 7.62,80.33 9.84,81.92 11.75,81.92 Q21.G
B4
  Bottom 0.406: TP14.P$1 7.94,61.91 9.53,63.5 Q28.G
B5
  Bottom 0.406: TP16.P$1 7.94,43.81 9.84,45.4 Q33.G
B6
  Bottom 0.406: TP18.P$1 7.94,26.04 9.53,27.3 Q38.G
B7
  Bottom 0.406: TP20.P$1 7.94,7.3 9.53,8.89 Q43.G
GND  (3 unrouted)
  pour Route2: 2.54,154.62 59.69,154.62 59.69,8.89 2.54,8.89
N$1
  Bottom 0.406: R2.2 D1.K
N$2
  Bottom 0.406: Q3.G 18.1,143.83 16.83,142.56 15.88,142.56 R1.1 15.24,142.56 14.29,142.56 | Q1.D 14.29,142.56 | R2.1 14.61,142.88 14.29,142.56
N$3
  Bottom 0.406: R8.2 34.29,126.05 36.83,123.51 D4.K
N$4
  Bottom 0.406: R4.2 D2.K
N$5
  Bottom 0.406: Q2.D 14.61,134.62 | 14.61,134.62 R3.1 | 14.61,134.62 R4.1 Q4.G
N$6
  Bottom 0.406: D5.K R10.2
N$7
  Bottom 0.406: R10.1 14.61,124.46 | 14.61,124.46 Q6.D | 14.61,124.46 14.92,124.14 R9.1 16.83,124.14 18.1,125.09 Q8.G
N$8
  Bottom 0.406: D6.K R12.2
N$9
  Bottom 0.406: R7.2 25.08,136.53 D3.K
N$10
  Bottom 0.406: Q9.G R12.1 14.61,116.52 | 14.61,116.52 Q7.D | R11.1 15.56,117.47 14.61,116.52
N$11
  Bottom 0.406: R15.2 25.08,118.75 D7.K
N$12
  Bottom 0.406: D8.K 34.61,85.09 30.8,88.9 30.8,106.68 29.21,108.58 R16.2
N$13
  Bottom 0.406: Q11.D 46.67,87.95 47.94,86.68 Q12.D 49.21,82.23 Q25.D 49.53,80.01 Q26.D Q47.D | Q47.D 48.58,71.44 Q48.D 48.58,66.67 | Q50.D 47.31,63.5 Q49.D 48.58,66.67 | Q47.D 51.75,72.39 Q13.G | R17.1 48.58,66.67
N$14
  Bottom 0.406: D10.K R22.2
N$15
  Bottom 0.406: R22.1 14.61,106.36 | 14.61,106.36 Q15.D | 14.61,106.36 14.92,106.05 R21.1 17.14,106.05 18.41,107.31 Q17.G
N$16
  Bottom 0.406: R24.2 D11.K
N$17
  Bottom 0.406: 14.61,98.74 R24.1 Q18.G | 14.61,98.74 R23.1 | 14.61,98.74 14.29,98.42 Q16.D
N$18
  Bottom 0.406: R27.2 24.77,100.33 D12.K
N$19
  Bottom 0.406: R20.2 56.83,80.96 58.42,79.69 D9.K
N$20
  Bottom 0.406: D13.K 35.88,81.6 R28.2
N$21
  Bottom 0.406: D14.K R30.2
N$22
  Bottom 0.406: R30.1 14.61,88.27 | 14.61,88.27 Q20.D | 14.61,88.27 14.92,87.95 R29.1 16.83,87.95 18.1,89.22 Q22.G
N$23
  Bottom 0.406: D15.K R32.2
N$24
  Bottom 0.406: Q23.G R32.1 14.61,80.33 | 14.61,80.33 R31.1 | 14.61,80.33 Q21.D
N$25
  Bottom 0.406: R35.2 25.08,82.55 D16.K
N$26
  Bottom 0.406: D17.K R36.2
N$27
  Bottom 0.406: D18.K R38.2
N$28
  Bottom 0.406: R38.1 14.61,70.17 | 14.61,70.17 Q27.D | 14.61,70.17 14.92,69.85 R37.1 16.51,69.85 18.1,71.44 Q29.G
N$29
  Bottom 0.406: D19.K R40.2
N$30
  Bottom 0.406: Q30.G R40.1 14.61,62.23 | 14.61,62.23 Q28.D | R39.1 15.56,63.18 14.61,62.23
N$31
  Bottom 0.406: R43.2 24.77,63.82 D20.K
N$32
  Bottom 0.406: R44.2 D21.K
N$33
  Bottom 0.406: D22.K R46.2
N$34
  Bottom 0.406: R46.1 14.61,52.07 | 14.61,52.07 Q32.D | 14.61,52.07 14.92,51.75 R45.1 16.83,51.75 18.1,53.02 Q34.G
N$35
  Bottom 0.406: R48.2 D23.K
N$36
  Bottom 0.406: Q35.G R48.1 14.61,44.13 | 14.61,44.13 Q33.D | R47.1 15.56,45.09 14.61,44.13
N$37
  Bottom 0.406: R51.2 25.08,45.72 D24.K
N$38
  Bottom 0.406: D25.K 32.07,69.85 29.53,67.63 29.53,59.05 27.94,57.15 27.62,56.83 R52.2
N$39
  Bottom 0.406: D26.K R54.2
N$40
  Bottom 0.406: R54.1 14.61,33.97 | 14.61,33.97 Q37.D | 14.61,33.97 14.92,33.66 R53.1 16.51,33.66 18.1,35.24 Q39.G
N$41
  Bottom 0.406: D27.K R56.2
N$42
  Bottom 0.406: 14.61,26.04 R56.1 Q40.G | 14.61,26.04 Q38.D | R55.1 15.56,26.99 14.61,26.04
N$43
  Bottom 0.406: R59.2 25.08,27.94 D28.K
N$44
  Bottom 0.406: D29.K 35.24,66.04 32.7,63.5 32.7,42.86 30.16,40.01 25.72,40.01 R60.2
N$45
  Bottom 0.406: D30.K R62.2
N$46
  Bottom 0.406: R62.1 14.61,15.56 | 14.61,15.56 Q42.D | 14.61,15.56 14.92,15.24 R61.1 16.83,15.24 18.1,16.51 Q44.G
N$47
  Bottom 0.406: D31.K R64.2
N$48
  Bottom 0.406: Q45.G R64.1 14.61,7.62 | 14.61,7.62 Q43.D | R63.1 15.56,8.57 14.61,7.62
N$49
  Bottom 0.406: R67.2 25.08,9.53 D32.K
N$50
  Bottom 0.406: D33.K 36.83,23.81 34.92,21.91 R68.2
RES
  Bottom 0.406: TP8.P$1 56.83,83.82 R18.1 50.8,83.19 50.8,78.11 51.91,76.99 | Q14.G 52.07,77.15 51.91,76.99 | 51.91,76.99 51.75,76.83 51.75,74.61 53.02,73.34 Q13.D
RES_N  (1 unrouted)
  Bottom 0.406: TP7.P$1 56.2,68.9 | 56.2,68.9 52.39,68.9 R19.1 | Q14.D 55.56,75.88 56.2,74.93 56.2,68.9

### Text on the board
tPlace: +5V | 0V | 8x2 AND/OR | (1) | JAMES NEWMAN